# Altium schematic sheet inernet_access.SchDoc
size A4
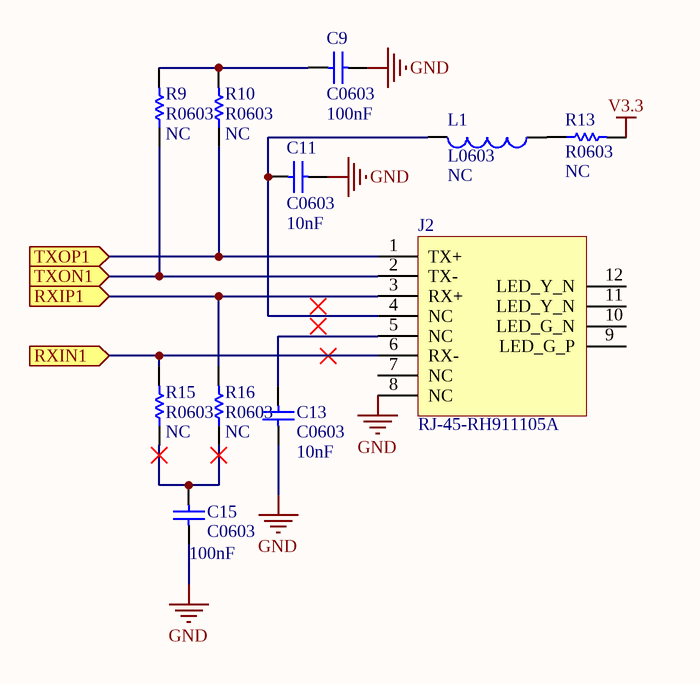
[diagram p0: inernet_access.SchDoc]

## Parts
C9  C0603  value 100nF  [R0603N]
C11  C0603  value 10nF  [R0603N]
C13  C0603  value 10nF  [R0603N]
C15  C0603  value 100nF  [R0603N]
J2  RJ-45-RH911105A  [RJ-45-RH911105A]
L1  L0603  value NC  [R0603N]
R9  R0603  value NC  [R0603N]
R10  R0603  value NC  [R0603N]
R13  R0603  value NC  [R0603N]
R15  R0603  value NC  [R0603N]
R16  R0603  value NC  [R0603N]

## Ports
RXIN1 (in), RXIP1 (in), TXON1 (in), TXOP1 (in)

## Nets
GND: C9.2 C11.2 C13.1 C15.1 J2.8(NC)
V3.3: R13.2
RXIN1: J2.6(RX-) R15.2 ; port RXIN1
RXIP1: J2.3(RX+) R16.2 ; port RXIP1
TXON1: J2.2(TX-) R9.1 ; port TXON1
TXOP1: J2.1(TX+) R10.1 ; port TXOP1
NetC9_1: C9.1 R9.2 R10.2
NetC11_1: C11.1 J2.4(NC) L1.2
NetC13_2: C13.2 J2.5(NC)
NetC15_2: C15.2 R15.1 R16.1
NetL1_1: L1.1 R13.1

Not connected (* = marked no-connect by the designer): J2 7(NC) 9(LED_G_P) 10(LED_G_N) 11(LED_Y_N) 12(LED_Y_N)

## Library data of the parts
C9 C11 C13 C15 = Cap Semi: Capacitor (Semiconductor SIM Model)
L1 = Inductor
R9 R10 R13 R15 R16 = Res Semi: Semiconductor Resistor